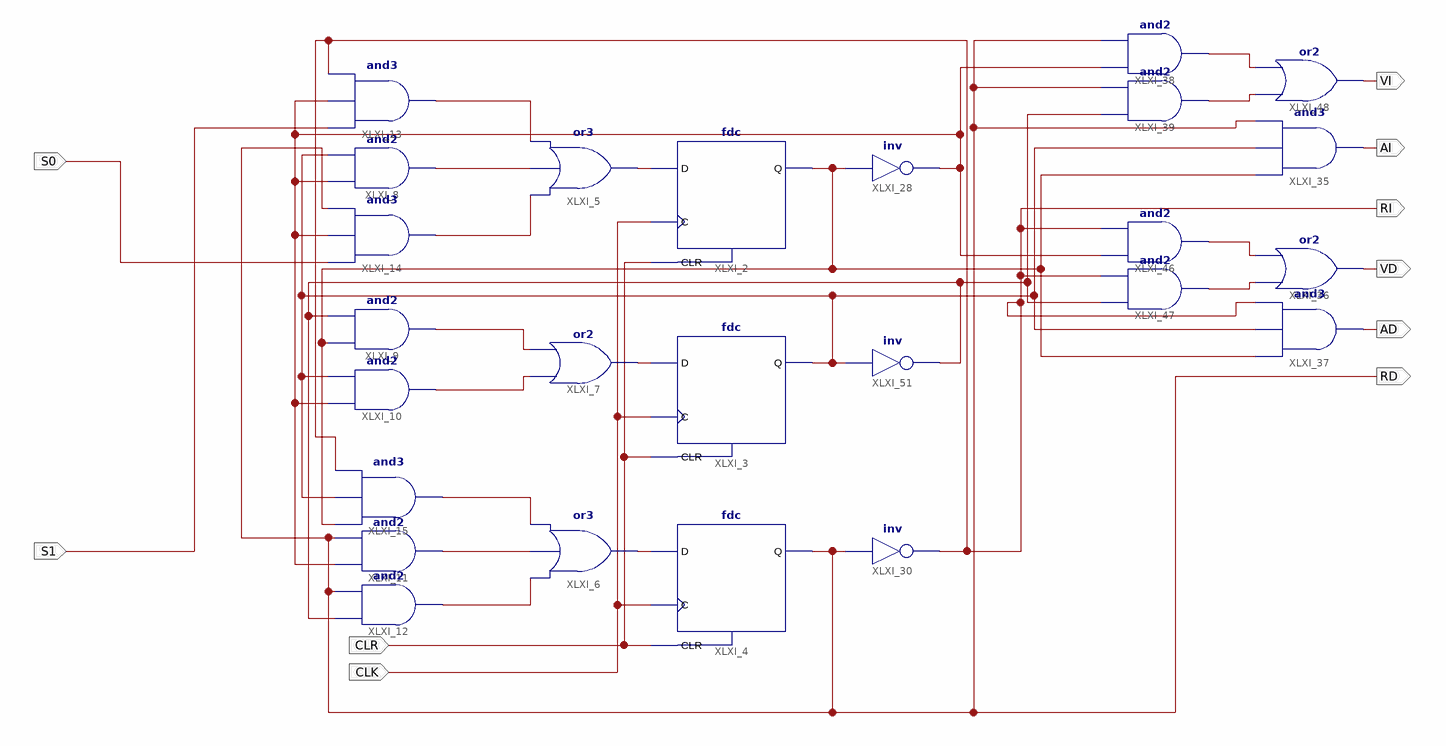
[diagram p0: schematic sheet 1]
// Xilinx ISE schematic p4ej1.sch (spartan3) as structural Verilog: 25 symbols, 10 ports
module p4ej1 (
  input  CLR,
  input  CLK,
  input  S0,
  input  S1,
  output RD,
  output RI,
  output VI,
  output AI,
  output VD,
  output AD
);

  wire XLXN_6, XLXN_7, XLXN_8, XLXN_9, XLXN_10, XLXN_11, XLXN_13, XLXN_14, XLXN_15, XLXN_16, XLXN_17,
       XLXN_60, XLXN_61, XLXN_64, XLXN_65, XLXN_81, XLXN_86, XLXN_90, XLXN_95;

  fdc XLXI_2 (.C(CLK), .CLR(CLR), .D(XLXN_6), .Q(XLXN_86));
  fdc XLXI_3 (.C(CLK), .CLR(CLR), .D(XLXN_8), .Q(XLXN_81));
  fdc XLXI_4 (.C(CLK), .CLR(CLR), .D(XLXN_7), .Q(RD));
  or XLXI_5 (XLXN_6, XLXN_11, XLXN_10, XLXN_9);
  or XLXI_6 (XLXN_7, XLXN_17, XLXN_16, XLXN_15);
  or XLXI_7 (XLXN_8, XLXN_14, XLXN_13);
  and XLXI_8 (XLXN_10, XLXN_95, XLXN_81);
  and XLXI_11 (XLXN_16, XLXN_95, RD);
  and XLXI_12 (XLXN_17, XLXN_90, RD);
  and XLXI_13 (XLXN_9, S1, XLXN_95, RI);
  and XLXI_14 (XLXN_11, S0, XLXN_95, RD);
  and XLXI_15 (XLXN_15, XLXN_86, XLXN_81, RI);
  and XLXI_9 (XLXN_13, XLXN_86, XLXN_90);
  and XLXI_10 (XLXN_14, XLXN_95, XLXN_81);
  not XLXI_28 (XLXN_95, XLXN_86);
  not XLXI_30 (RI, RD);
  and XLXI_35 (AI, XLXN_86, XLXN_81, RD);
  or XLXI_36 (VD, XLXN_65, XLXN_64);
  and XLXI_37 (AD, XLXN_86, XLXN_81, RI);
  and XLXI_38 (XLXN_60, XLXN_95, RD);
  and XLXI_39 (XLXN_61, XLXN_90, RD);
  and XLXI_47 (XLXN_65, XLXN_90, RI);
  or XLXI_48 (VI, XLXN_61, XLXN_60);
  and XLXI_46 (XLXN_64, XLXN_95, RI);
  not XLXI_51 (XLXN_90, XLXN_81);
endmodule
